# EAGLE schematic main (EAGLE 6.3)
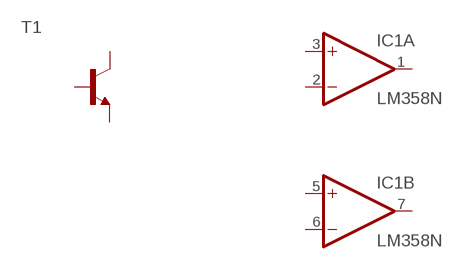
[diagram p0: schematic, sheet 1]

## Parts
IC1  LM358N  [DIL08]
T1  BF199-NPN-TO92-BEC  [TO92-BEC]
Unconnected: IC1.1(A:OUT) IC1.2(A:-IN) IC1.3(A:+IN) IC1.5(B:+IN) IC1.6(B:-IN) IC1.7(B:OUT) T1.B T1.C T1.E

## Power pins joined to a net without a drawn wire
V+: IC1.8(P:V+)
V-: IC1.4(P:V-)

## Library data of the parts
IC1 = linear:LM358: OP AMP also LM158; LM258; LM2904 Source: http://cache.national.com/ds/LM/LM158.pdf
T1 = transistor:*-NPN-: NPN Transistror BF959 corrected 2008.03.06